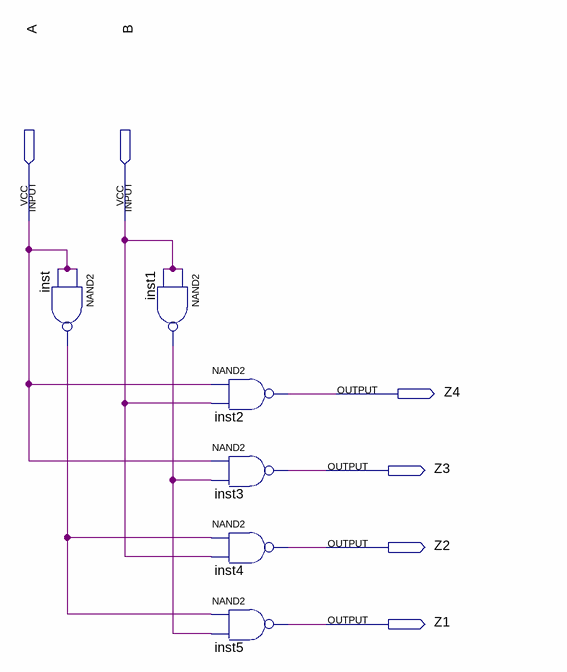
[diagram p0: schematic sheet]
// Quartus schematic Decodificador2.bdf as structural Verilog: 6 symbols, 6 pins
module Decodificador2 (
  input  A,
  input  B,
  output Z4,
  output Z3,
  output Z2,
  output Z1
);

  wire inst1_out, inst_out;

  nand inst (inst_out, A, A);
  nand inst1 (inst1_out, B, B);
  nand inst2 (Z4, A, B);
  nand inst3 (Z3, A, inst1_out);
  nand inst4 (Z2, inst_out, B);
  nand inst5 (Z1, inst_out, inst1_out);
endmodule
